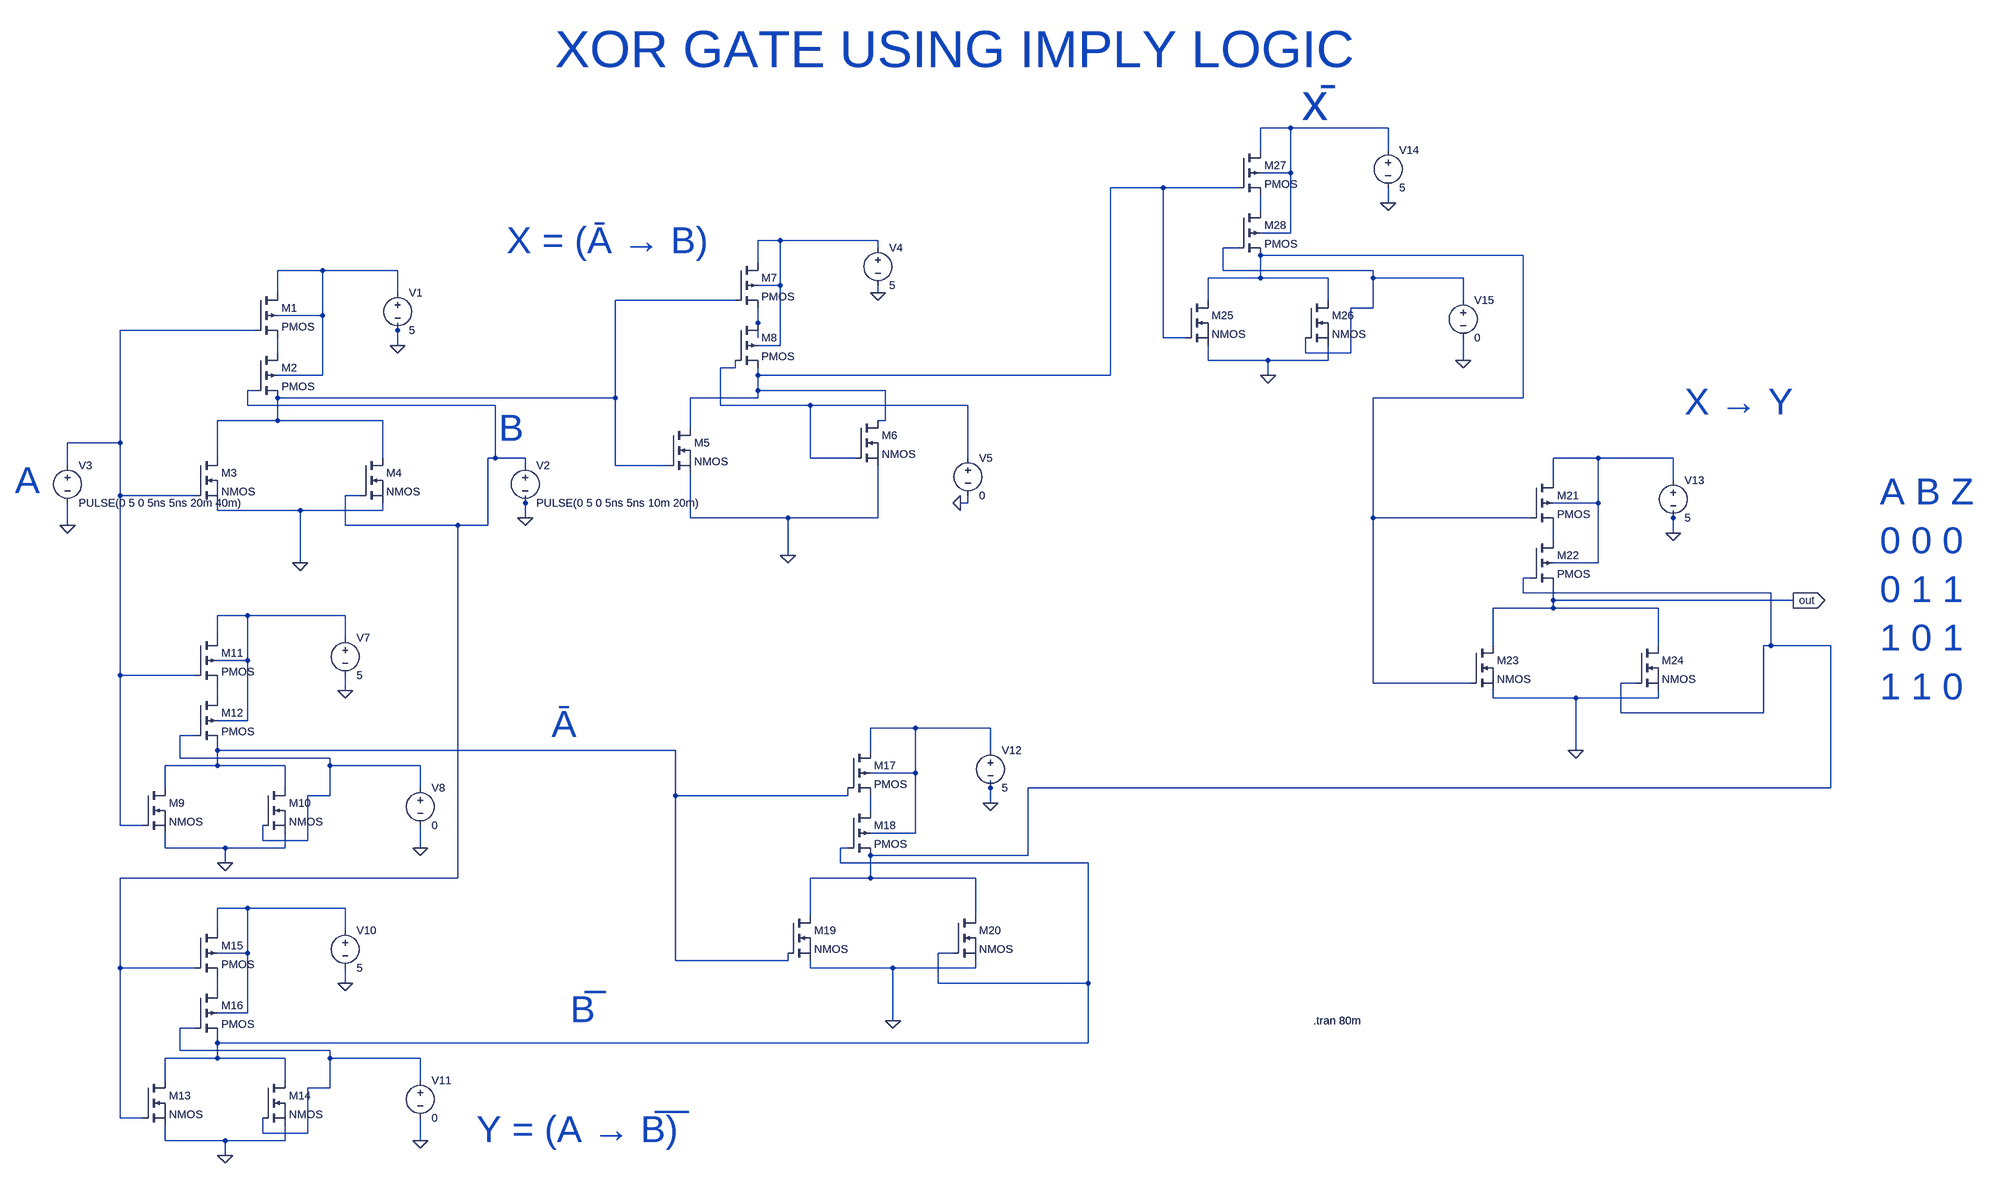
[diagram p0: schematic originalxorusingimply.asc]
originalxorusingimply.asc, the LTspice schematic file:
Version 4
SHEET 1 2684 1800
WIRE 1168 -480 1104 -480
WIRE 1376 -480 1168 -480
WIRE 1104 -432 1104 -480
WIRE 1376 -432 1376 -480
WIRE 1168 -384 1168 -480
WIRE 1168 -384 1104 -384
WIRE 896 -352 784 -352
WIRE 1056 -352 896 -352
WIRE 1376 -320 1376 -352
WIRE 1104 -304 1104 -336
WIRE 1168 -256 1168 -384
WIRE 1168 -256 1104 -256
WIRE 80 -240 32 -240
WIRE 288 -240 80 -240
WIRE 288 -224 288 -240
WIRE 1056 -224 1024 -224
WIRE 1664 -208 1104 -208
WIRE 32 -192 32 -240
WIRE -896 -176 -992 -176
WIRE -736 -176 -896 -176
WIRE 1024 -176 1024 -224
WIRE 1344 -176 1024 -176
WIRE 1104 -160 1104 -208
WIRE 1104 -160 992 -160
WIRE 1248 -160 1104 -160
WIRE 1344 -160 1344 -176
WIRE 1536 -160 1344 -160
WIRE 80 -144 80 -240
WIRE 80 -144 32 -144
WIRE -992 -128 -992 -176
WIRE -736 -128 -736 -176
WIRE 288 -128 288 -144
WIRE -16 -112 -272 -112
WIRE 992 -112 992 -160
WIRE 1248 -112 1248 -160
WIRE 1536 -112 1536 -160
WIRE 1344 -96 1344 -160
WIRE 1344 -96 1296 -96
WIRE -896 -80 -896 -176
WIRE -896 -80 -992 -80
WIRE 32 -64 32 -96
WIRE -1040 -48 -1328 -48
WIRE -736 -48 -736 -64
WIRE 32 -32 32 -64
WIRE 896 -32 896 -352
WIRE 944 -32 896 -32
WIRE -736 -16 -736 -48
WIRE 80 -16 80 -144
WIRE 80 -16 32 -16
WIRE -992 0 -992 -32
WIRE 1200 0 1200 -32
WIRE 1296 0 1296 -96
WIRE 1296 0 1200 0
WIRE 992 16 992 -16
WIRE 1120 16 992 16
WIRE 1248 16 1248 -16
WIRE 1248 16 1120 16
WIRE 1536 16 1536 -32
WIRE -16 32 -16 16
WIRE -16 32 -48 32
WIRE -896 48 -896 -80
WIRE -896 48 -992 48
WIRE 32 48 32 32
WIRE 784 48 784 -352
WIRE 784 48 32 48
WIRE 1120 48 1120 16
WIRE -1040 80 -1056 80
WIRE 32 80 32 48
WIRE 304 80 32 80
WIRE -272 96 -272 -112
WIRE -272 96 -992 96
WIRE 32 96 32 80
WIRE 32 96 -112 96
WIRE 1664 96 1664 -208
WIRE 1664 96 1344 96
WIRE -1056 112 -1056 80
WIRE -528 112 -1056 112
WIRE -48 112 -48 32
WIRE 144 112 -48 112
WIRE 480 112 144 112
WIRE -992 144 -992 96
WIRE -992 144 -1120 144
WIRE -768 144 -992 144
WIRE 304 144 304 80
WIRE 304 144 288 144
WIRE -112 160 -112 96
WIRE -1328 192 -1328 -48
WIRE -1328 192 -1440 192
WIRE -1120 224 -1120 144
WIRE -768 224 -768 144
WIRE -528 224 -528 112
WIRE -528 224 -544 224
WIRE -464 224 -528 224
WIRE 144 224 144 112
WIRE 240 224 144 224
WIRE 480 224 480 112
WIRE 1824 224 1728 224
WIRE 1984 224 1824 224
WIRE -1440 240 -1440 192
WIRE -464 240 -464 224
WIRE -272 240 -272 96
WIRE -160 240 -272 240
WIRE 1728 272 1728 224
WIRE 1984 272 1984 224
WIRE -1328 304 -1328 192
WIRE -1168 304 -1328 304
WIRE -816 304 -848 304
WIRE -464 320 -464 304
WIRE 480 320 480 304
WIRE 480 320 464 320
WIRE 1824 320 1824 224
WIRE 1824 320 1728 320
WIRE -1120 336 -1120 320
WIRE -944 336 -1120 336
WIRE -768 336 -768 320
WIRE -768 336 -944 336
WIRE -464 352 -464 320
WIRE -112 352 -112 256
WIRE 96 352 -112 352
WIRE 288 352 288 240
WIRE 288 352 96 352
WIRE 1344 352 1344 96
WIRE 1680 352 1344 352
WIRE 1984 352 1984 336
WIRE -1440 368 -1440 320
WIRE -848 368 -848 304
WIRE -608 368 -848 368
WIRE -544 368 -544 224
WIRE -544 368 -608 368
WIRE 1984 384 1984 352
WIRE 1728 400 1728 368
WIRE 96 432 96 352
WIRE -944 448 -944 336
WIRE 1824 448 1824 320
WIRE 1824 448 1728 448
WIRE 1680 480 1664 480
WIRE 1664 512 1664 480
WIRE 2192 512 1664 512
WIRE 1728 528 1728 496
WIRE 2240 528 1728 528
WIRE 1728 544 1728 528
WIRE 1728 544 1600 544
WIRE 1952 544 1728 544
WIRE -1056 560 -1120 560
WIRE -848 560 -1056 560
WIRE -1120 608 -1120 560
WIRE -848 608 -848 560
WIRE 1600 624 1600 544
WIRE 1952 624 1952 544
WIRE 2192 624 2192 512
WIRE 2192 624 2176 624
WIRE 2320 624 2192 624
WIRE -1056 656 -1056 560
WIRE -1056 656 -1120 656
WIRE -1328 688 -1328 304
WIRE -1168 688 -1328 688
WIRE 1344 704 1344 352
WIRE 1552 704 1344 704
WIRE 1904 704 1872 704
WIRE -848 720 -848 688
WIRE -1120 736 -1120 704
WIRE 1600 736 1600 720
WIRE 1776 736 1600 736
WIRE 1952 736 1952 720
WIRE 1952 736 1776 736
WIRE 1872 768 1872 704
WIRE 2176 768 2176 624
WIRE 2176 768 1872 768
WIRE -1056 784 -1056 656
WIRE -1056 784 -1120 784
WIRE 368 800 272 800
WIRE 528 800 368 800
WIRE -1168 816 -1200 816
WIRE -1120 848 -1120 832
WIRE -144 848 -1120 848
WIRE 272 848 272 800
WIRE 528 848 528 800
WIRE 1776 848 1776 736
WIRE -1200 864 -1200 816
WIRE -880 864 -1200 864
WIRE -1120 880 -1120 848
WIRE -1120 880 -1232 880
WIRE -976 880 -1120 880
WIRE -880 880 -880 864
WIRE -688 880 -880 880
WIRE 368 896 368 800
WIRE 368 896 272 896
WIRE -1232 928 -1232 880
WIRE -976 928 -976 880
WIRE -688 928 -688 880
WIRE 528 928 528 912
WIRE 2320 928 2320 624
WIRE 2320 928 608 928
WIRE -880 944 -880 880
WIRE -880 944 -928 944
WIRE -144 944 -144 848
WIRE 224 944 224 928
WIRE 224 944 -144 944
WIRE 528 960 528 928
WIRE 272 976 272 944
WIRE -1328 1008 -1328 688
WIRE -1280 1008 -1328 1008
WIRE 368 1024 368 896
WIRE 368 1024 272 1024
WIRE -1024 1040 -1024 1008
WIRE -928 1040 -928 944
WIRE -928 1040 -1024 1040
WIRE -1232 1056 -1232 1024
WIRE -1104 1056 -1232 1056
WIRE -976 1056 -976 1024
WIRE -976 1056 -1104 1056
WIRE -688 1056 -688 1008
WIRE 224 1056 208 1056
WIRE 608 1072 608 928
WIRE 608 1072 272 1072
WIRE -1104 1088 -1104 1056
WIRE 208 1088 208 1056
WIRE 736 1088 208 1088
WIRE -608 1120 -608 368
WIRE -608 1120 -1328 1120
WIRE 272 1120 272 1072
WIRE 272 1120 144 1120
WIRE 496 1120 272 1120
WIRE -1056 1184 -1120 1184
WIRE -848 1184 -1056 1184
WIRE 144 1200 144 1120
WIRE 496 1200 496 1120
WIRE -1120 1232 -1120 1184
WIRE -848 1232 -848 1184
WIRE -1056 1280 -1056 1184
WIRE -1056 1280 -1120 1280
WIRE 448 1280 416 1280
WIRE -144 1296 -144 944
WIRE 96 1296 96 1280
WIRE 96 1296 -144 1296
WIRE -1328 1312 -1328 1120
WIRE -1168 1312 -1328 1312
WIRE 144 1312 144 1296
WIRE 320 1312 144 1312
WIRE 496 1312 496 1296
WIRE 496 1312 320 1312
WIRE -848 1344 -848 1312
WIRE 416 1344 416 1280
WIRE 736 1344 736 1088
WIRE 736 1344 416 1344
WIRE -1120 1360 -1120 1328
WIRE -1056 1408 -1056 1280
WIRE -1056 1408 -1120 1408
WIRE 320 1424 320 1312
WIRE -1168 1440 -1200 1440
WIRE -1120 1472 -1120 1456
WIRE 736 1472 736 1344
WIRE 736 1472 -1120 1472
WIRE -1200 1488 -1200 1440
WIRE -880 1488 -1200 1488
WIRE -1120 1504 -1120 1472
WIRE -1120 1504 -1232 1504
WIRE -976 1504 -1120 1504
WIRE -880 1504 -880 1488
WIRE -688 1504 -880 1504
WIRE -1232 1552 -1232 1504
WIRE -976 1552 -976 1504
WIRE -688 1552 -688 1504
WIRE -880 1568 -880 1504
WIRE -880 1568 -928 1568
WIRE -1328 1632 -1328 1312
WIRE -1280 1632 -1328 1632
WIRE -1024 1664 -1024 1632
WIRE -928 1664 -928 1568
WIRE -928 1664 -1024 1664
WIRE -1232 1680 -1232 1648
WIRE -1104 1680 -1232 1680
WIRE -976 1680 -976 1648
WIRE -976 1680 -1104 1680
WIRE -688 1680 -688 1632
WIRE -1104 1712 -1104 1680
FLAG -1440 368 0
FLAG -944 448 0
FLAG -464 352 0
FLAG -736 -16 0
FLAG 288 -128 0
FLAG 96 432 0
FLAG 464 320 0
FLAG -848 720 0
FLAG -1104 1088 0
FLAG -688 1056 0
FLAG -848 1344 0
FLAG -1104 1712 0
FLAG -688 1680 0
FLAG 1776 848 0
FLAG 1984 384 0
FLAG 1376 -320 0
FLAG 1120 48 0
FLAG 1536 16 0
FLAG 2240 528 out
IOPIN 2240 528 Out
FLAG 320 1424 0
FLAG 528 960 0
SYMBOL pmos4 -1040 -128 R0
SYMATTR InstName M1
SYMBOL pmos4 -1040 0 R0
SYMATTR InstName M2
SYMBOL nmos -1168 224 R0
SYMATTR InstName M3
SYMBOL nmos -816 224 R0
SYMATTR InstName M4
SYMBOL voltage -736 -144 R0
WINDOW 123 0 0 Left 0
WINDOW 39 0 0 Left 0
SYMATTR InstName V1
SYMATTR Value 5
SYMBOL voltage -464 224 R0
WINDOW 123 0 0 Left 0
WINDOW 39 0 0 Left 0
SYMATTR InstName V2
SYMATTR Value PULSE(0 5 0 5ns 5ns 10m 20m)
SYMBOL voltage -1440 224 R0
WINDOW 123 0 0 Left 0
WINDOW 39 0 0 Left 0
SYMATTR InstName V3
SYMATTR Value PULSE(0 5 0 5ns 5ns 20m 40m)
SYMBOL nmos -160 160 R0
SYMATTR InstName M5
SYMBOL nmos 240 144 R0
SYMATTR InstName M6
SYMBOL voltage 288 -240 R0
WINDOW 123 0 0 Left 0
WINDOW 39 0 0 Left 0
SYMATTR InstName V4
SYMATTR Value 5
SYMBOL voltage 480 208 R0
WINDOW 123 0 0 Left 0
WINDOW 39 0 0 Left 0
SYMATTR InstName V5
SYMATTR Value 0
SYMBOL pmos4 -16 -192 R0
SYMATTR InstName M7
SYMBOL pmos4 -16 -64 R0
SYMATTR InstName M8
SYMBOL nmos -1280 928 R0
SYMATTR InstName M9
SYMBOL voltage -848 592 R0
WINDOW 123 0 0 Left 0
WINDOW 39 0 0 Left 0
SYMATTR InstName V7
SYMATTR Value 5
SYMBOL voltage -688 912 R0
WINDOW 123 0 0 Left 0
WINDOW 39 0 0 Left 0
SYMATTR InstName V8
SYMATTR Value 0
SYMBOL nmos -1024 928 R0
SYMATTR InstName M10
SYMBOL pmos4 -1168 608 R0
SYMATTR InstName M11
SYMBOL pmos4 -1168 736 R0
SYMATTR InstName M12
SYMBOL nmos -1280 1552 R0
SYMATTR InstName M13
SYMBOL voltage -848 1216 R0
WINDOW 123 0 0 Left 0
WINDOW 39 0 0 Left 0
SYMATTR InstName V10
SYMATTR Value 5
SYMBOL voltage -688 1536 R0
WINDOW 123 0 0 Left 0
WINDOW 39 0 0 Left 0
SYMATTR InstName V11
SYMATTR Value 0
SYMBOL nmos -1024 1552 R0
SYMATTR InstName M14
SYMBOL pmos4 -1168 1232 R0
SYMATTR InstName M15
SYMBOL pmos4 -1168 1360 R0
SYMATTR InstName M16
SYMBOL pmos4 1680 272 R0
SYMATTR InstName M21
SYMBOL pmos4 1680 400 R0
SYMATTR InstName M22
SYMBOL nmos 1552 624 R0
SYMATTR InstName M23
SYMBOL nmos 1904 624 R0
SYMATTR InstName M24
SYMBOL voltage 1984 256 R0
WINDOW 123 0 0 Left 0
WINDOW 39 0 0 Left 0
SYMATTR InstName V13
SYMATTR Value 5
SYMBOL nmos 944 -112 R0
SYMATTR InstName M25
SYMBOL voltage 1376 -448 R0
WINDOW 123 0 0 Left 0
WINDOW 39 0 0 Left 0
SYMATTR InstName V14
SYMATTR Value 5
SYMBOL voltage 1536 -128 R0
WINDOW 123 0 0 Left 0
WINDOW 39 0 0 Left 0
SYMATTR InstName V15
SYMATTR Value 0
SYMBOL nmos 1200 -112 R0
SYMATTR InstName M26
SYMBOL pmos4 1056 -432 R0
SYMATTR InstName M27
SYMBOL pmos4 1056 -304 R0
SYMATTR InstName M28
SYMBOL pmos4 224 848 R0
SYMATTR InstName M17
SYMBOL pmos4 224 976 R0
SYMATTR InstName M18
SYMBOL nmos 96 1200 R0
SYMATTR InstName M19
SYMBOL nmos 448 1200 R0
SYMATTR InstName M20
SYMBOL voltage 528 832 R0
WINDOW 123 0 0 Left 0
WINDOW 39 0 0 Left 0
SYMATTR InstName V12
SYMATTR Value 5
TEXT -504 -240 Left 6 ;X = (Ā → B)
TEXT 1216 1424 Left 2 !.tran 80m
TEXT -1552 272 Left 6 ;A
TEXT -368 1400 Left 6 ;B̅
TEXT -408 792 Left 6 ;Ā
TEXT -568 1656 Left 6 ;Y = (A → B̅)̅
TEXT 1192 -536 Left 7 ;x̄
TEXT 2008 104 Left 6 ;X → Y
TEXT -400 -648 Left 7 ;XOR GATE USING IMPLY LOGIC
TEXT 2456 296 Left 6 ;A B Z \n0 0 0\n0 1 1\n1 0 1\n1 1 0
TEXT -520 160 Left 6 ;B

The netlist it stands for:
* originalxorusingimply.asc
M1 N007 N010 N011 N007 PMOS
M2 N011 N013 N008 N007 PMOS
M3 N008 N010 0 0 NMOS
M4 N008 N013 0 0 NMOS
V1 N007 0 5
V2 N013 0 PULSE(0 5 0 5ns 5ns 10m 20m)
V3 N010 0 PULSE(0 5 0 5ns 5ns 20m 40m)
M5 N002 N008 0 0 NMOS
M6 N002 N012 0 0 NMOS
V4 N004 0 5
V5 N012 0 0
M7 N004 N008 N009 N004 PMOS
M8 N009 N012 N002 N004 PMOS
M9 N021 N010 0 0 NMOS
V7 N017 0 5
V8 N020 0 0
M10 N021 N020 0 0 NMOS
M11 N017 N010 N018 N017 PMOS
M12 N018 N020 N021 N017 PMOS
M13 N023 N013 0 0 NMOS
V10 N024 0 5
V11 N026 0 0
M14 N023 N026 0 0 NMOS
M15 N024 N013 N025 N024 PMOS
M16 N025 N026 N023 N024 PMOS
M21 N014 N006 N015 N014 PMOS
M22 N015 N016 out N014 PMOS
M23 out N006 0 0 NMOS
M24 out N016 0 0 NMOS
V13 N014 0 5
M25 N006 N002 0 0 NMOS
V14 N001 0 5
V15 N005 0 0
M26 N006 N005 0 0 NMOS
M27 N001 N002 N003 N001 PMOS
M28 N003 N005 N006 N001 PMOS
M17 N019 N021 N022 N019 PMOS
M18 N022 N023 N016 N019 PMOS
M19 N016 N021 0 0 NMOS
M20 N016 N023 0 0 NMOS
V12 N019 0 5
.model NMOS NMOS
.model PMOS PMOS
.lib standard.mos
* X = (Ā → B)
.tran 80m
* A
* B̅
* Ā
* Y = (A → B̅)̅
* x̄
* X → Y
* XOR GATE USING IMPLY LOGIC
* A B Z
* 0 0 0
* 0 1 1
* 1 0 1
* 1 1 0
* B
.backanno
.end